# Altium schematic sheet Tead_Aliens_64A_Audio.SchDoc: Tead Aliens 64A Audio
size A4; Date: 27/01/2021; ApprovedBy: NeperMath; CheckedBy: NeperMath; Author: NeperMath; DrawnBy: NeperMath; Engineer: NeperMath; DocumentNumber: 1; SheetNumber: 1; SheetTotal: 1; CurrentTime: 20:24; CurrentDate: 27/01/2021; Time: 20:23
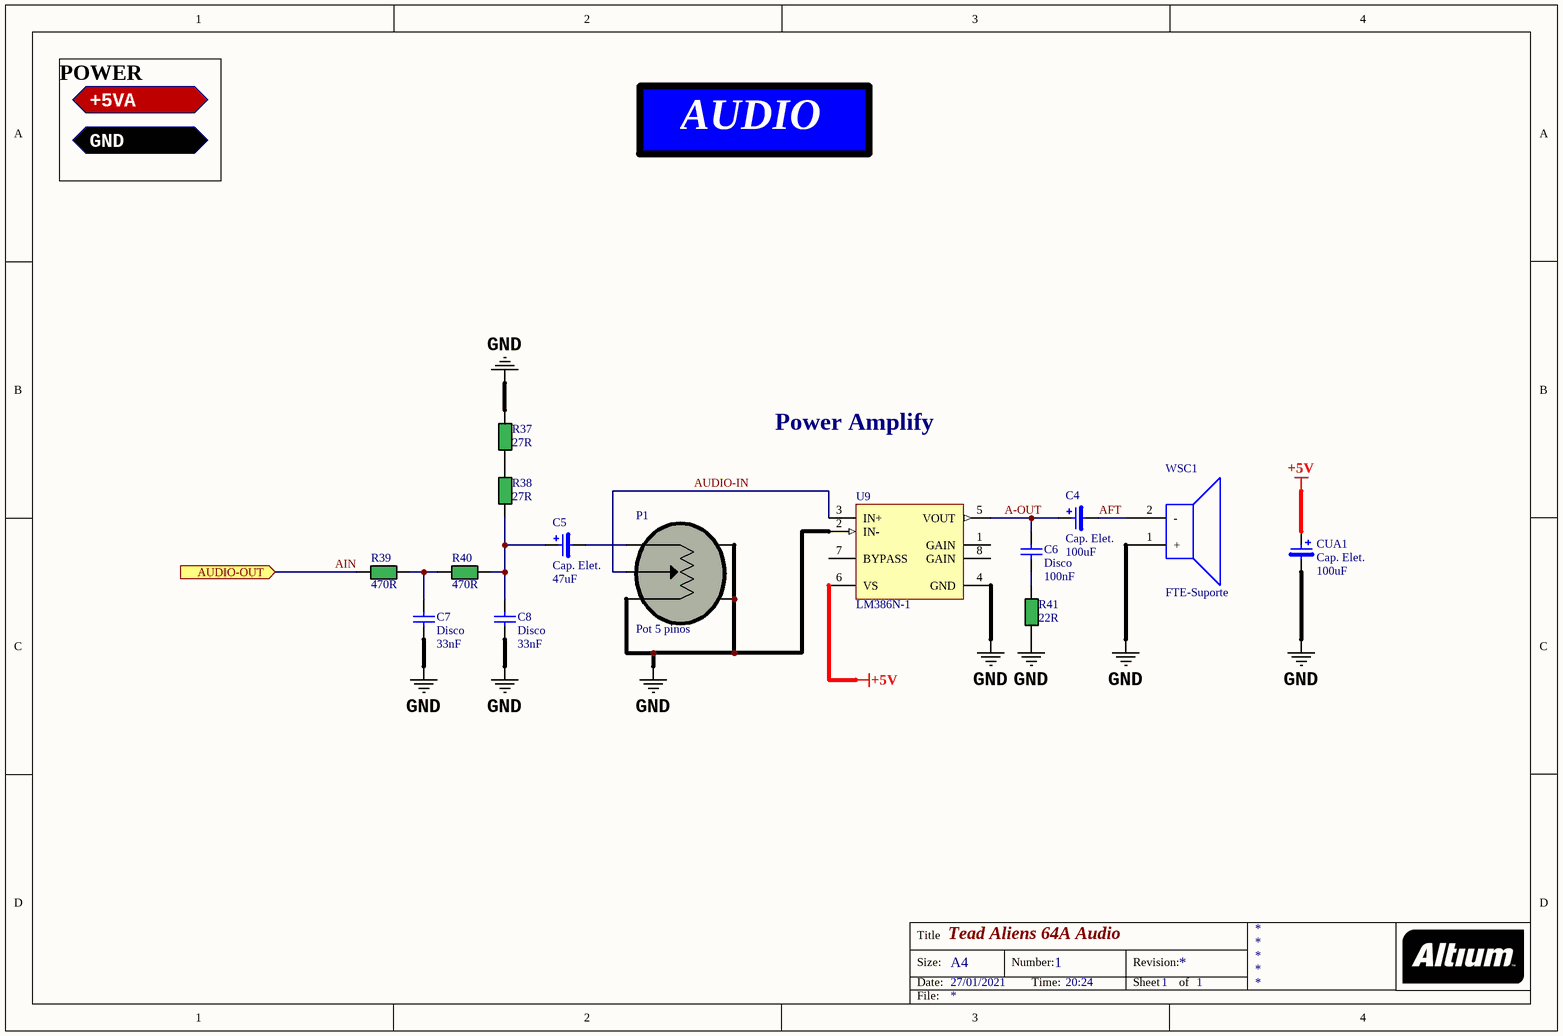
[diagram p0: Tead_Aliens_64A_Audio.SchDoc]

## Parts
C4  Cap. Elet.  value 100uF  [CAP_RADIAL_2_10_16]
C5  Cap. Elet.  value 47uF  [CAP ELE RAD 11mm H]
C6  Disco  value 100nF  [CAP CER DISK 3MM]
C7  Disco  value 33nF  [CAP CER DISK 3MM]
C8  Disco  value 33nF  [CAP CER DISK 3MM]
CUA1  Cap. Elet.  value 100uF  [CAP_RADIAL_2_10_16]
P1  Pot 5 pinos  [POT CHINA MICRO]
R37  value 27R  [RES_0805]  (hidden comment: Resistor Generic)
R38  value 27R  [RES_0805]  (hidden comment: Resistor Generic)
R39  value 470R  [RES_0805]  (hidden comment: Resistor Generic)
R40  value 470R  [RES_0805]  (hidden comment: Resistor Generic)
R41  value 22R  [RES 300 CR25]  (hidden comment: Resistor Generic)
U9  LM386N-1  [DIP8]
WSC1  FTE-Suporte  [FTE-WBC-8OHM-1W-23mm]

## Ports
+5VA, AUDIO-OUT (in), GND

## Nets
+5V: CUA1.1 U9.6(VS)
GND: C7.1 C8.1 CUA1.2 P1.3 P1.4 P1.5 R37.2 R41.1 U9.2(IN-) U9.4(GND) WSC1.1(+)
A-OUT: C4.1 C6.2 U9.5(VOUT)
AFT: C4.2 WSC1.2(-)
AIN: R39.1 ; port AUDIO-OUT
AUDIO-IN: P1.2 U9.3(IN+)
NetC5_1: C5.1 C8.2 R38.1 R40.2
NetC5_2: C5.2 P1.1
NetC6_1: C6.1 R41.2
NetC7_2: C7.2 R39.2 R40.1
NetR37_1: R37.1 R38.2

Not connected (* = marked no-connect by the designer): U9 1(GAIN) 7(BYPASS) 8(GAIN)

## Notes on the sheet
- POWER
- AUDIO
- Power Amplify
- Title
- Size:
- Date:
- A4
- Number:
- Time:
- Revision:
- Sheet
- of
- File:

## Library data of the parts
C4 C5 CUA1 = CAP_RADIAL_ELETROLITICO: Capacitor Radial Eletrolitico
C6-C8 = CAP_DISCO: SMD Capacitor 1210 size
P1 = POT 5 pinos china: Potenciometer 5 pins
R37-R41 = Resistor Generic: Generic Resistor
U9 = LM386N-1: Low Voltage Audio Power Amplifier; Manufacturer: National Semiconductor; CompType: Audio IC; PackageTopMarking: NSUZXYTT*LM*386N-1; Published: 4-Dec-2008; DatasheetVersion: Aug-2000; PackageVersion: revG, May-2006; PackageReference: N08E; PackageDescription: MDIP, .365 x .250 x .130in, 8 Lead, .100in Pitch; PartNumber: LM386N-1; RoHS: O; PinCount: 8; DigiKeyPartNumber: LM386N-1-ND; Code_JEDEC: MS-001-BA; ComponentLink1Description: LM386 Datasheet; ComponentLink1URL: http://www.national.com/ds/LM/LM386.pdf; ComponentLink2Description: LM386 Web Page; ComponentLink2URL: http://www.national.com/pf/LM/LM386.html; ComponentLink3Description: N08E Package Page; ComponentLink3URL: http://www.national.com/packaging/folders/n08e.html
WSC1 = FTE-WBC 8 OHM 23mm X 4.5mm: FTE-WBC-8 OHM 23mm X 4.5mm